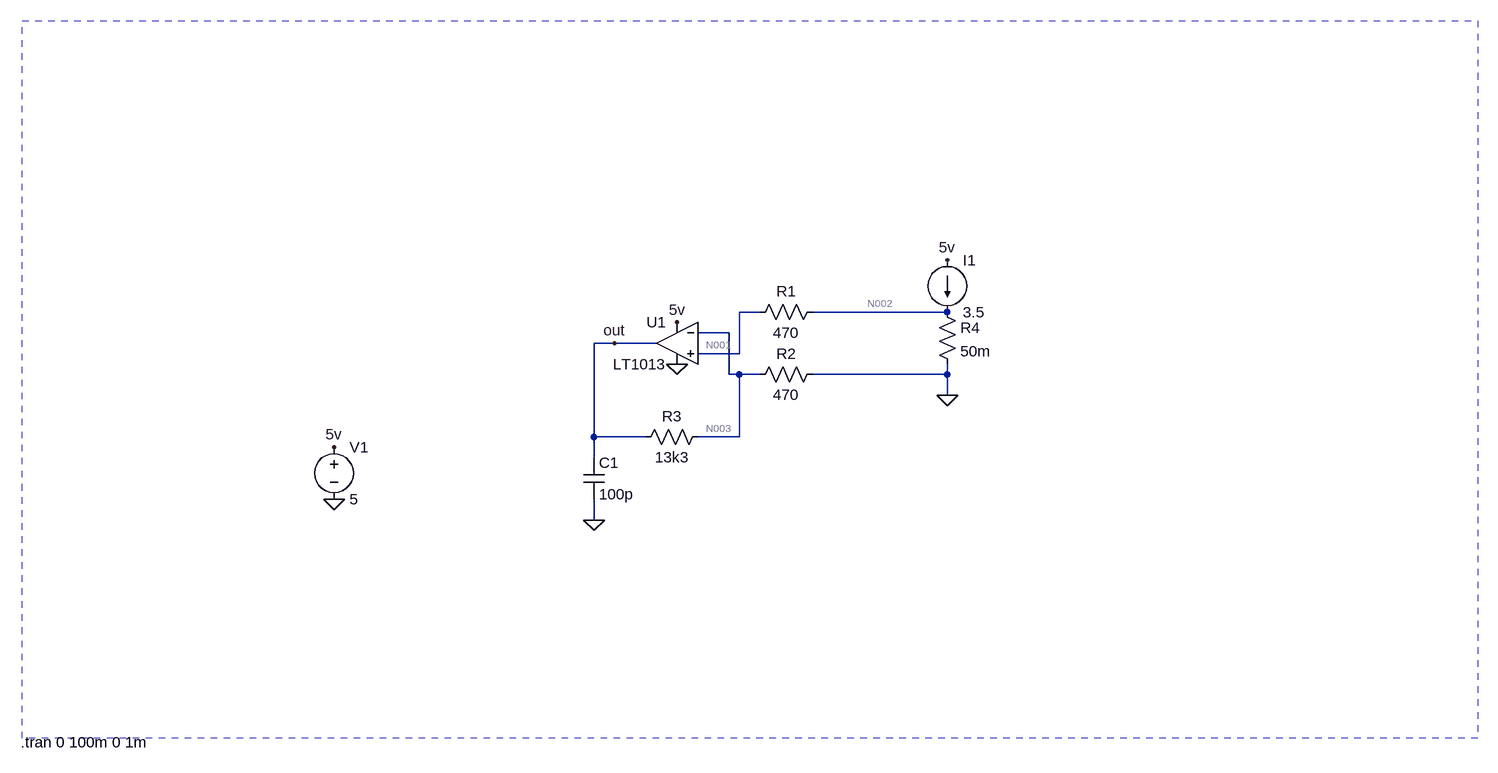
[diagram p0: schematic drive_isense.asc]
drive_isense.asc, the LTspice schematic file:
Version 4
SHEET 1 1028 744
WIRE -80 64 -112 64
WIRE 208 64 0 64
WIRE -128 96 -176 96
WIRE -304 112 -336 112
WIRE -240 112 -304 112
WIRE -112 128 -112 64
WIRE -112 128 -176 128
WIRE -128 160 -128 96
WIRE -112 160 -128 160
WIRE -80 160 -112 160
WIRE 208 160 208 144
WIRE 208 160 0 160
WIRE 208 192 208 160
WIRE -336 256 -336 112
WIRE -256 256 -336 256
WIRE -112 256 -112 160
WIRE -112 256 -176 256
WIRE -336 288 -336 256
WIRE -336 384 -336 352
FLAG -736 272 5v
FLAG -208 80 5v
FLAG -208 144 0
FLAG -736 352 0
FLAG 208 192 0
FLAG -336 384 0
FLAG -304 112 out
FLAG 208 -16 5v
SYMBOL res 16 48 R90
WINDOW 0 0 56 VBottom 2
WINDOW 3 32 56 VTop 2
SYMATTR InstName R1
SYMATTR Value 470
SYMBOL res 16 144 R90
WINDOW 0 0 56 VBottom 2
WINDOW 3 32 56 VTop 2
SYMATTR InstName R2
SYMATTR Value 470
SYMBOL Opamps\\LT1013 -208 48 M0
SYMATTR InstName U1
SYMBOL voltage -736 256 R0
SYMATTR InstName V1
SYMATTR Value 5
SYMBOL res -160 240 R90
WINDOW 0 0 56 VBottom 2
WINDOW 3 32 56 VTop 2
SYMATTR InstName R3
SYMATTR Value 13k3
SYMBOL cap -352 288 R0
SYMATTR InstName C1
SYMATTR Value 100p
SYMBOL res 192 48 R0
SYMATTR InstName R4
SYMATTR Value 50m
SYMBOL current 208 -16 R0
WINDOW 123 0 0 Left 2
WINDOW 39 0 0 Left 2
SYMATTR InstName I1
SYMATTR Value 3.5
TEXT -1218 726 Left 2 !.tran 0 100m 0 1m
RECTANGLE Normal 1024 720 -1216 -384 2

The netlist it stands for:
* drive_isense.asc
R1 N002 N001 470
R2 0 N003 470
XU1 N001 N003 5v 0 out LT1013  ; pins In+ In- V+ V- OUT
V1 5v 0 5
R3 N003 out 13k3
C1 out 0 100p
R4 N002 0 50m
I1 5v N002 3.5
.tran 0 100m 0 1m
.lib LTC.lib
.backanno
.end

* Results of the author's LTspice run, read from the files saved beside the schematic
* Operating Point, zero values left out:
*   V(n002) = 175 mV
*   V(n001) = 175 mV
*   V(n003) = 148.4 mV
*   V(5v) = 5 V
*   V(out) = 4.347 V
*   I(I1) = 3.5 A
*   I(R4) = 3.5 A
*   I(R3) = -315.7 µA
*   I(R2) = -315.7 µA
*   I(R1) = -12.18 nA
*   I(V1) = -3.501 A
*   Ix(u1:1) = -12.18 nA
*   Ix(u1:2) = -12.3 nA
*   Ix(u1:3) = 521.7 µA
*   Ix(u1:4) = -210 µA
*   Ix(u1:5) = -315.7 µA